# EAGLE schematic AnalogDaisy (EAGLE 8.4.3)
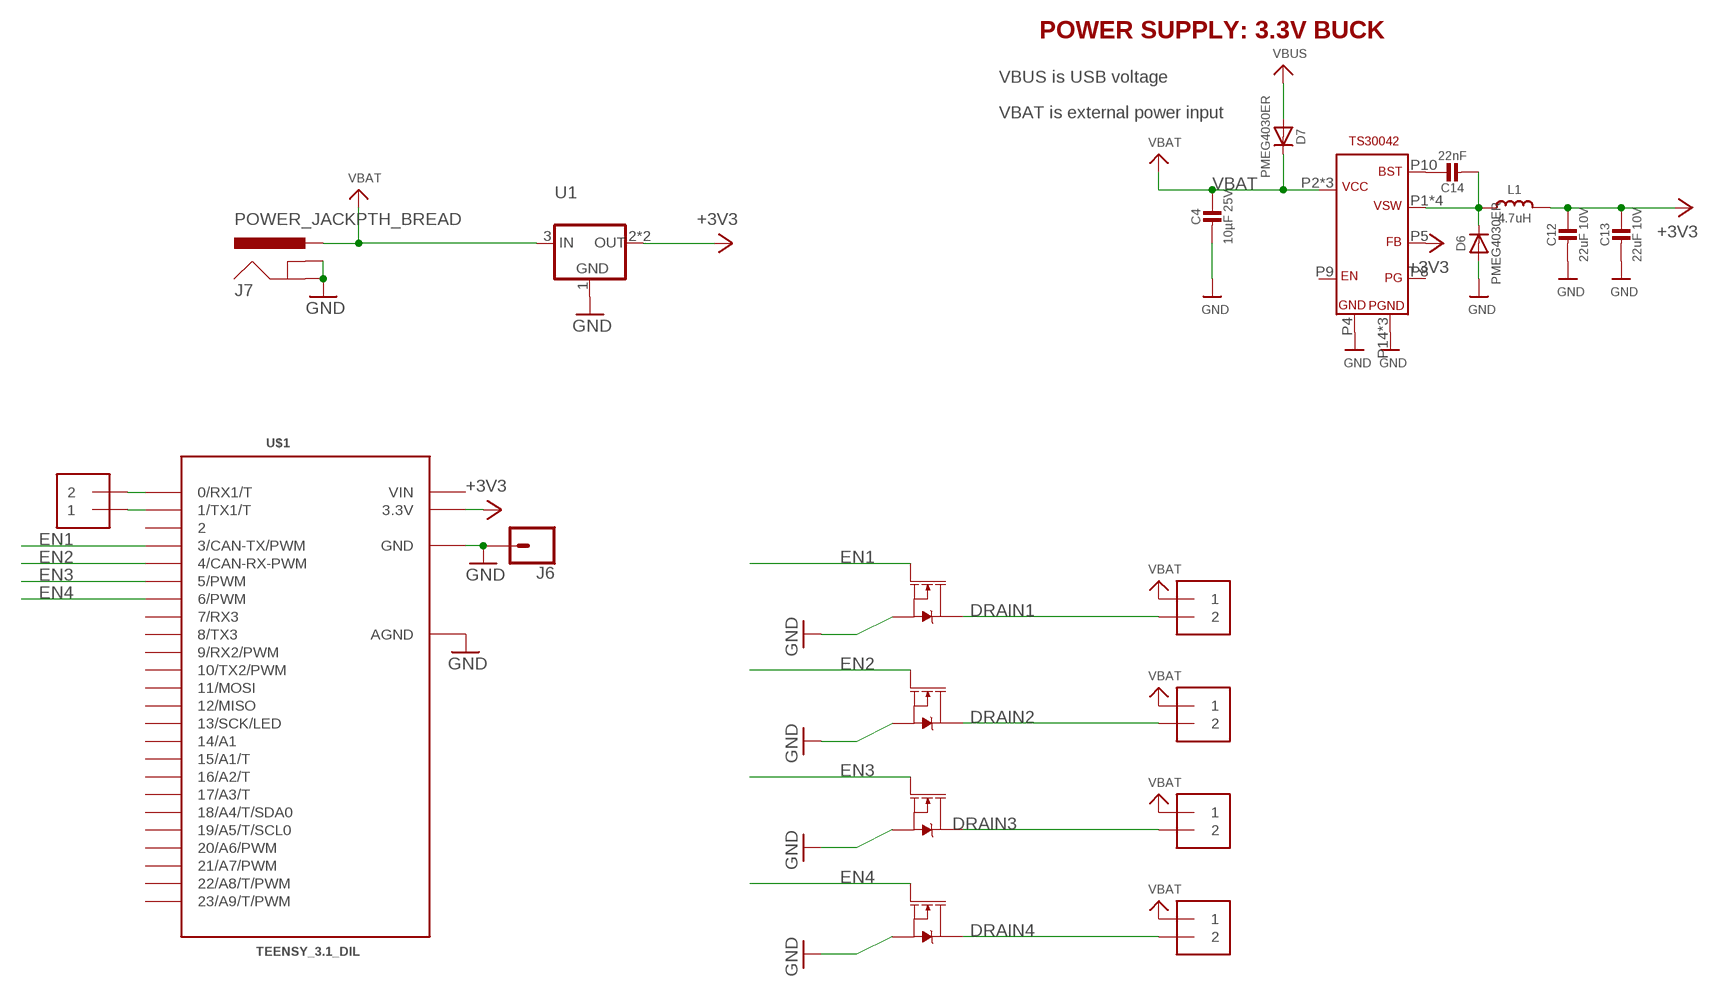
[diagram p0: schematic, sheet 1]

## Parts
C4  10µF 25V  CAP_CERAMIC0603MINI  [0603-MINI]
C12  22uF 10V  CAP_CERAMIC0603MINI  [0603-MINI]
C13  22uF 10V  CAP_CERAMIC0603MINI  [0603-MINI]
C14  22nF  CAP_CERAMIC0603MINI  [0603-MINI]
D6  PMEG4030ER  DIODESOD-123  [SOD-123]
D7  PMEG4030ER  DIODESOD-123  [SOD-123]
J1  1X2-3.5MM  [1X2-3.5MM]
J2  1X2-3.5MM  [1X2-3.5MM]
J3  1X2-3.5MM  [1X2-3.5MM]
J4  1X2-3.5MM  [1X2-3.5MM]
J5  1X2-3.5MM  [1X2-3.5MM]
J6  CONN_01  [1X01]
J7  POWER_JACKPTH_BREAD  [POWER_JACK_PTH_BREAD]
L1  4.7uH  INDUCTORTDK_VLC5045  [INDUCTOR_5X5MM_TDK_VLC5045]
Q1  35A/25V/8.5mΩ  MOSFET-NCH-FDD8780  [DPAK]
Q3  35A/25V/8.5mΩ  MOSFET-NCH-FDD8780  [DPAK]
Q5  35A/25V/8.5mΩ  MOSFET-NCH-FDD8780  [DPAK]
Q6  35A/25V/8.5mΩ  MOSFET-NCH-FDD8780  [DPAK]
U1  VREG_SOT223  [SOT223-R]
U$1  TEENSY_3.1_DIL  [TEENSY3-DIL]
U$19  BUCK_CONVERTER  [QFN-16]

## Nets
+3V3: C12.1 C13.1 L1.P$2 U1.2(OUT) U1.4(OUT) U$1.3.3V U$19.P5(FB)
DRAIN1: J2.2 Q1.4(D)
DRAIN2: J3.2 Q3.4(D)
DRAIN3: J4.2 Q5.4(D)
DRAIN4: J5.2 Q6.4(D)
EN1: Q1.1(G) U$1.3(3/CAN-TX/PWM)
EN2: Q3.1(G) U$1.4(4/CAN-RX-PWM)
EN3: Q5.1(G) U$1.5(5/PWM)
EN4: Q6.1(G) U$1.6(6/PWM)
GND: C4.2 C12.2 C13.2 D6.A J6.1 J7.GND J7.GNDBREAK Q1.3(S) Q3.3(S) Q5.3(S) Q6.3(S) U1.1(GND) U$1.AGND U$1.GND U$19.P4(GND) U$19.P14(PGND) U$19.P15(PGND) U$19.PAD(PGND)
N$1: J1.1 U$1.1(1/TX1/T)
N$2: J1.2 U$1.0(0/RX1/T)
N$14: C14.1 U$19.P10(BST)
N$16: C14.2 D6.C L1.P$1 U$19.P1(VSW) U$19.P12(VSW) U$19.P13(VSW) U$19.P16(VSW)
VBAT: C4.1 D7.C J2.1 J3.1 J4.1 J5.1 J7.PWR U1.3(IN) U$19.P2(VCC) U$19.P3(VCC) U$19.P11(VCC)
VBUS: D7.A
Unconnected: U$1.2 U$1.7(7/RX3) U$1.8(8/TX3) U$1.9(9/RX2/PWM) U$1.10(10/TX2/PWM) U$1.11(11/MOSI) U$1.12(12/MISO) U$1.13(13/SCK/LED) U$1.14/A0(14/A1) U$1.15/A1(15/A1/T) U$1.16/A2(16/A2/T) U$1.17/A3(17/A3/T) U$1.18/A4(18/A4/T/SDA0) U$1.19/A5(19/A5/T/SCL0) U$1.20/A6(20/A6/PWM) U$1.21/A7(21/A7/PWM) U$1.22/A8(22/A8/T/PWM) U$1.23/A9(23/A9/T/PWM) U$19.P8(PG) U$19.P9(EN)

## Notes on the sheet
- POWER SUPPLY: 3.3V BUCK
- VBUS is USB voltage
- VBAT is external power input

## Power pins joined to a net without a drawn wire
VIN: U$1.VIN

## Library data of the parts
C4 C12-C14 = microbuilder:CAP_CERAMIC: Ceramic Capacitors For new designs, use the packages preceded by an '_' character since they are more reliable: The following footprints should be used on most boards: _0402 - Standard footprint for regular board layouts _0603 - Standard footprint for regular board layouts _0805 - Standard footprint for regular board layouts _1206 - Standard footprint for regular board layouts For extremely tight-pitch boards where space is at a premium, the following 'micro-pitch' footprints can be used (smaller pads, no silkscreen outline, etc.): _0402MP - Micro-pitch footprint for very dense/compact boards _0603MP - Micro-pitch footprint for very dense/compact boards _0805MP - Micro-pitch footprint for very dense/compact boards _1206MP - Micro-pitch footprint for very dense/compact boards
D6 D7 = microbuilder:DIODE: Diode SMA Model Volts Amps Type Vf Ir Digikey # Notes SSA34-E3 40V 3A Schottky 480mV @ 3A 200uA @ 40V SSA34-E3/61TGITR-ND CDBA120-G 20V 1A Schottky 500mV @ 1A 500uA @ 20V 641-1014-6-ND REEL MBRA210 10V 2A Schottky 350mV @ 2A 700uA @ 10V MBRA210LT3 SOD-123 Model Volts Amps Type Vf Ir Order # Notes BAT54T1G 30V 200mA Schottky 800mV @ 200mA 2uA @ 25V BAT54T1GOSTR-ND B0530W 30V 500mA Schottky 430mV @ 500mA 130uA @ 30V B0530W-FDICT-ND REEL MBR120 20V 1A Schottky 340mV @ 1A MBR120VLSFT1GOSCT-ND SOD-323 Model Volts Amps Type Vf Ir Order # Notes PMEG2005EJ 20V 500mA Schottky 355mV @ 500mA 568-4110-1-ND ZLLS410 10V 570mA Schottky 380mV @ 570mA ZLLS410CT-ND 1N4148WS 75V 150mA Silicon/Simple 1V 1N4148WSFSCT-ND REEL SOD-523 Model Volts Amps Type Vf Ir Order # Notes BAT54XV2 30V 200mA Schottky 0.8V @ 100mA BAT54XV2CT-ND TB751S 30V 30mA Schottky RB751S-40TE61CT-ND SOT23-R/W (R = Solder Paste/Reflow Ovens, W = Hand-Soldering) Model Volts Amps Type Vf Ir Order # Notes BAT54FILM 40V 300mA Schottky 497-7162-1-ND POWERDI-5 Model Volts Amps Type Vf Ir Order # Notes PDS560 60V 5A Schottky 670mV @ 5A 150uA @ 60V PDS560DICT-ND
J1-J5 = adafruit:1X2: 3.5mm Terminal block http://www.ladyada.net/library/pcb/eaglelibrary.html
J6 = SparkFun-Connectors:CONN_01: Single connection point. Often used as Generic Header-pin footprint for 0.1 inch spaced/style header connections On any of the 0.1 inch spaced packages, you can populate with these: Break Away Headers - Straight <https://www.sparkfun.com/products/116> (PRT-00116) Break Away Male Headers - Right Angle <https://www.sparkfun.com/products/553> (PRT-00553) Female Headers <https://www.sparkfun.com/products/115> (PRT-00115) Break Away Headers - Machine Pin <https://www.sparkfun.com/products/117> (PRT-00117) Break Away Female Headers - Swiss Machine Pin <https://www.sparkfun.com/products/743> (PRT-00743) This device is also useful as a general connection point to wire up your design to another part of your project. Our various solder wires solder well into these plated through hole pads. Hook-Up Wire - Assortment (Stranded, 22 AWG) <https://www.sparkfun.com/products/11375> (PRT-11375) Hook-Up Wire - Assortment (Solid Core, 22 AWG) <https://www.sparkfun.com/products/11367> (PRT-11367) View the entire wire category on our website here <https://www.sparkfun.com/categories/141> Special notes: SMTSO-256-ET is a "flush mount" nut for a 4-40 screw. We mostly use this on specialty testbeds; it is a nice way to connect hardware to your PCB at an adjustable hieght. Also note, the SNAP packages are for using a snappable style connector. We sell a baggie of snaps and they are also used on two LilyPad designs: Snap Assortment - 30 pack (male and female) <https://www.sparkfun.com/products/11347> (DEV-11347) LilyPad Arduino SimpleSnap <https://www.sparkfun.com/products/10941> (DEV-10941) LilyPad SimpleSnap Protoboard <https://www.sparkfun.com/products/10940> (DEV-10940)
J7 = SparkFun-Connectors:POWER_JACK: Power Jack Connector This is the standard 5.5mm barrel jack for power. The PTH is the most common, proven, reliable, footprint. The Slot footprint only works if the mill layer is transmitted to the PCB fab house so be warned. Here are the connectors we sell at SparkFun: DC Barrel Power Jack/Connector <https://www.sparkfun.com/products/119> (PRT-00119) DC Barrel Power Jack/Connector (SMD) <https://www.sparkfun.com/products/12748> (PRT-12748) DC Barrel Jack Adapter - Breadboard Compatible <https://www.sparkfun.com/products/10811> (PRT-10811) It is used on this SparkFun product (and many, many others): SparkFun RedBoard - Programmed with Arduino <https://www.sparkfun.com/products/12757> (DEV-12757) Also, if you need a mating power supply or connector, please check these out: Wall Adapter Power Supply - 9VDC 650mA <https://www.sparkfun.com/products/298> (TOL-00298) DC Barrel Jack Adapter - Male <https://www.sparkfun.com/products/10287> (PRT-10287); PROD_ID: PRT-10811
L1 = microbuilder:INDUCTOR: Inductors 0603: 10nH Ceramic Inductor - microwire antenna/RF (Digikey: 712-1434-2-ND) 0805: 560nH Ceramic Inductor - RF (Digikey: 553-1047-1-ND) 270nH Ceramic Inductor - Q = 40@250MHz, +-5%, 1 Ohm DC Resistance (Digikey: 535-10506-2-ND) 1007 (2518 Metric) SMT: 10µH 10% 250mOhm 820mA 1007 Inductor (Digikey: 587-2189-1-ND) 22µH 10% 500mOhm 580mA 1007 Inductor (Digikey: 587-2190-1-ND) 47µH 10% 950mOhm 420mA 1007 Inductor (Digikey: 587-2191-1-ND) 47µH 5% 100mOhm 1A 1008 Inductor (Digikey: 732-1816-1-ND) 5.0x5.0mm (Taiyo Yuden NR5040 Series) 6.8µH 20% 2.3A 64mOhm Inductor (Digikey: 587-2374-2-ND) 5.0x5.0mm (TDK VLC5045 Series) 4.7µH 20% 3.3A 34mOhm Inductor (Digikey: 445-6526-1-ND) 6.8µH 20% 2.7A 46mOhm Inductor (Digikey: 445-6527-1-ND) 6.0x6.0mm (TDK VLC6045 Series) 4.7µH 20% 3.8A 27mOhm Inductor (Digikey: 445-6538-2-ND) 6.8µH 20% 3A 41mOhm Inductor (Digikey: 445-6540-1-ND) 6.2µH 30% 2.2A 45mOhm Inductor (Digikey: SRR5028-6R2YCT-ND) - Not TDK VLC6045 but footprint should match 6.0x6.0mm (TDK SLF6045 Series) 6.8uH 30% 2A 33mOhm Inductor (Digikey: 445-4572-1-ND, Mouser: 810-SLF645T6R8N2R0PF) 6.0x6.0mm (Sumida CDRH5D28 Series) 6.2uH 30% 1.8A 45mOhm Inductor (Digikey: 308-1542-1-ND) Taiyo Yuden NR3015T2R2M - 2.2uH 20% 1.5A (Digikey: 587-1648-2-ND, Mouser: 963-NR3015T2R2M) - Used with TI TPS62172 CoilCraft RFID Transponder Coil - MA5532-AE (For use with AS3935 Lightning Sensor) Taiyo Yuden NRH2412T2R2MNGH - 2.2uH 20% 1AA (Digikey: 587-3443-1-ND) - Used with TI LM3671 Vishay IHLP 1.0uH Molded Inductor - 24mOhm DCR, 5A, +/-20%, -55°C-125°C (Digikey: 541-1319-1-ND)
Q1 Q3 Q5 Q6 = SparkFun-DiscreteSemi:MOSFET-NCH: N-channel MOSFETs Voltage controlled devices that allow control of high current outputs. SparkFun Products: SparkFun OpenScale <https://www.sparkfun.com/products/13261> SparkFun Digital Sandbox <https://www.sparkfun.com/products/12651> SparkFun Monster Moto Shield <https://www.sparkfun.com/products/10182> SparkFun MOSFET Power Controller <https://www.sparkfun.com/products/11214>; PROD_ID: TRANS-09984
U1 = microbuilder:VREG_SOT223: SOT-223 Fixed Voltage Regulators Part Current Out V Out V In V Dropout θJA (°C/W) TJ (°C) Operating Temp Digikey Part No. AP1117 1A 3.3V 18V 1.1V@500mA, 1.3V@1A 107°C/W 150°C -40°C-125°C AP1117IE33G-13DICT-ND Max operating temp can be calculated using θJA, TJ (max junction temperature), and power in watts. Set the "Maximum Ambient Temperature" until it reaches TJ ("Max Junction Temperature"), which is the absolute limit for safe use of the regulator: Heat Sink Temperature Calculator <http://www.daycounter.com/Calculators/Heat-Sink-Temperature-Calculator.phtml> For example, With 12V source into a 3.3V LP2985 and a 30mA load, we are dissipating (12V-3.3V) * 0.03A = 0.261W. With a θJA of 206 °C/W, a TJ of 150°C, and 261mW we can safely use the chip without a heat sink up to 75°C (=147.1°C Junction Temperature).
U$1 = Teensy_3_and_LC_Series_Boards_v1.0:TEENSY_3.1_DIL: Teensy 3.1 or 3.2 in a DIL Layout.
U$19 = Heep:BUCK_CONVERTER